# Altium schematic sheet LED_Shield_PCB_v11.SchDoc
size A4; SheetNumber: 1; SheetTotal: 1
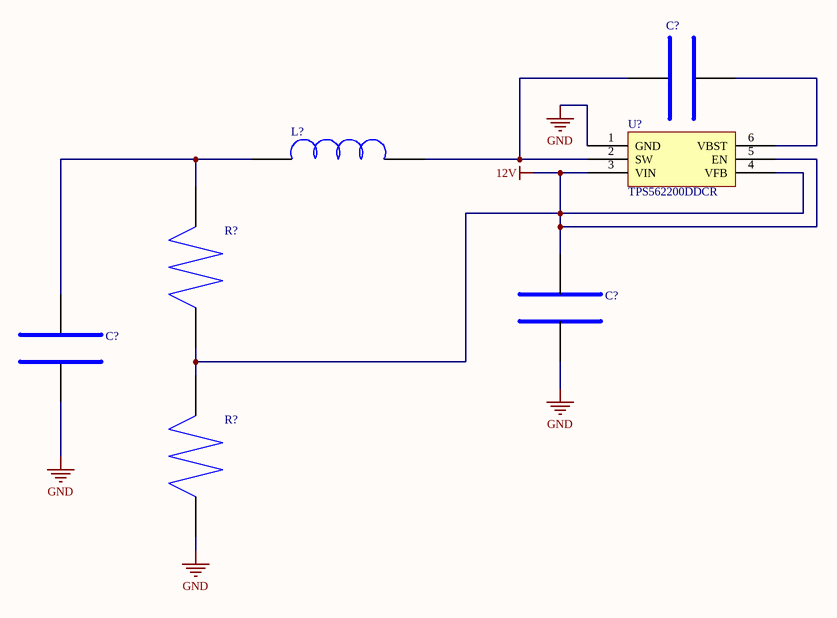
[diagram p0: LED_Shield_PCB_v11.SchDoc]

## Parts
(Parts that share a designator on the sheet are numbered #1, #2 ... from top to bottom, then left to right.)
C?#1  KGM21NR71E104KT  [C_0805 (2012 Metric)_2]  (value not drawn)
C?#2  MSAST219LB5106KTNA01  [C_0805 (2012 Metric)]  (value not drawn)
C?#3  MSASL219LB5226MTNA01  [C_0805 (2012 Metric)_3]  (value not drawn)
L?  XGL4030-472MEC  [L_1616 (4040 Metric)]  (value not drawn)
R?#1  RC0201FR-0756K2L  (value not drawn)
R?#2  RC0201FR-0710KL  [R_0201 (0603 Metric)_2]  (value not drawn)
U?  TPS562200DDCR  [U_SOT-23-6 Thin, TSOT-23-6]

## Nets
12V: C?#2.1 R?#1.0 R?#2.1 U?.3(VIN) U?.4(VFB) U?.5(EN)
GND: C?#2.0 C?#3.0 R?#2.0 U?.1(GND)
NetC?#1_0: C?#1.0 L?.1 U?.2(SW)
NetC?#1_1: C?#1.1 U?.6(VBST)
NetC?#3_1: C?#3.1 L?.0 R?#1.1

## Library data of the parts
C?#1 = KGM21NR71E104KT: Ceramic Capacitor, Multilayer, Ceramic, 25V, 10% +Tol, 10% -Tol, X7R, 15% TC, 0.1uF, Surface Mount, 0805; Manufacturer: KYOCERA AVX; Value: 100nF; Supplier: Future Electronics; Supplier Part Number: 4183759; Manufacturer Part Number: KGM21NR71E104KT; RoHS: Compliant; Category: Ceramic Capacitors; Stock: 4000; Pricing: 4000=0,0166, 12000=0,0162, 20000=0,016, 60000=0,0157, 100000=0,0153 (USD); Dielectric Material: Ceramic; Height: 1mm; Length: 2.01mm; Lifecycle Status: Production; Max Operating Temperature: 125°C; Min Operating Temperature: -55°C; Mounting Technology: Surface Mount; Number of Terminals: 2; REACH SVHC: Yes; Voltage Rating (DC): 25V; Width: 1.25mm; ComponentLink1URL: https://datasheet.octopart.com:443/KGM21NR71E104KT-KYOCERA-AVX-datasheet-179280988.pdf?src-supplier=IHS; ComponentLink1Description: https://datasheet.octopart.com:443/KGM21NR71E104KT-KYOCERA-AVX-datasheet-179280988.pdf?src-supplier=IHS; ComponentLink2URL: https://datasheet.octopart.com:443/KGM21NR71E104KT-KYOCERA-AVX-datasheet-178027269.pdf?src-supplier=TME; ComponentLink2Description: https://datasheet.octopart.com:443/KGM21NR71E104KT-KYOCERA-AVX-datasheet-178027269.pdf?src-supplier=TME; ComponentLink3URL: https://datasheet.octopart.com:443/KGM21NR71E104KT-KYOCERA-AVX-datasheet-175509538.pdf?src-supplier=Future+Electronics; ComponentLink3Description: https://datasheet.octopart.com:443/KGM21NR71E104KT-KYOCERA-AVX-datasheet-175509538.pdf?src-supplier=Future+Electronics; ComponentLink4URL: http://sigma.octopart.com:80/conflict_mineral_statement/AVX-company-34.pdf?src-supplier=Compliance+Statements; ComponentLink4Description: http://sigma.octopart.com:80/conflict_mineral_statement/AVX-company-34.pdf?src-supplier=Compliance+Statements; ComponentLink5URL: http://sigma.octopart.com:80/reach_statement/AVX-company-19.pdf?src-supplier=Compliance+Statements; ComponentLink5Description: http://sigma.octopart.com:80/reach_statement/AVX-company-19.pdf?src-supplier=Compliance+Statements
C?#2 = MSAST219LB5106KTNA01: Ceramic Capacitor, Multilayer, Ceramic, 25V, 10% +Tol, 10% -Tol, X5R, 15% TC, 10uF, Surface Mount, 0805; Manufacturer: TAIYO YUDEN; Value: 10µF; Supplier: Arrow Electronics; Supplier Part Number: MSAST219LB5106KTNA01; Manufacturer Part Number: MSAST219LB5106KTNA01; RoHS: Compliant; Category: Ceramic Capacitors; Stock: 7; Pricing: 1=0,0066 (USD); Dielectric Material: Ceramic; Export Control Classification Number (ECCN) Code: EAR99; Height: 850µm; Harmonized Tariff Schedule (HTS) Code: 8532.24.00.20; Introduction Date: 2022-02-17; Length: 2mm; Lifecycle Status: Production; Max Operating Temperature: 85°C; Min Operating Temperature: -55°C; Mounting Technology: Surface Mount; Number of Terminals: 2; REACH SVHC: Yes; Voltage Rating (DC): 25V; Width: 1.25mm; ComponentLink1URL: https://datasheet.octopart.com:443/MSAST219LB5106KTNA01-Taiyo-Yuden-datasheet-182126366.pdf?src-supplier=IHS; ComponentLink1Description: https://datasheet.octopart.com:443/MSAST219LB5106KTNA01-Taiyo-Yuden-datasheet-182126366.pdf?src-supplier=IHS
C?#3 = MSASL219LB5226MTNA01: Ceramic Capacitor, Multilayer, Ceramic, 10V, 20% +Tol, 20% -Tol, X5R, 15% TC, 22uF, Surface Mount, 0805; Manufacturer: TAIYO YUDEN; Value: 22µF; Supplier: Mouser; Supplier Part Number: 963-MSASL219LB5226MT; Manufacturer Part Number: MSASL219LB5226MTNA01; RoHS: Compliant; Category: Ceramic Capacitors; Stock: 10806; Pricing: 1=0,27, 10=0,114, 50=0,114, 100=0,101, 1000=0,072, 10000=0,067 (USD); Dielectric Material: Ceramic; Export Control Classification Number (ECCN) Code: EAR99; Height: 850µm; Harmonized Tariff Schedule (HTS) Code: 8532.24.00.20; Introduction Date: 2022-02-17; Length: 2mm; Lifecycle Status: Production; Max Operating Temperature: 85°C; Min Operating Temperature: -55°C; Mounting Technology: Surface Mount; Number of Terminals: 2; REACH SVHC: Yes; Voltage Rating (DC): 10V; Width: 1.25mm; ComponentLink1URL: https://datasheet.octopart.com:443/MSASL219LB5226MTNA01-Taiyo-Yuden-datasheet-182125419.pdf?src-supplier=IHS; ComponentLink1Description: https://datasheet.octopart.com:443/MSASL219LB5226MTNA01-Taiyo-Yuden-datasheet-182125419.pdf?src-supplier=IHS
L? = XGL4030-472MEC: 4.7 µH Shielded Molded Inductor 6.6 A 31.5mOhm Max 1616 (4040 Metric)
R?#1 = RC0201FR-0756K2L: Res Thick Film 0201 56.2K Ohm 1% 0.05W(1/20W) ±200ppm/C Molded SMD Paper T/R; Manufacturer: Yageo Group; Max Power Dissipation: 50mW; Value: 56.2kΩ; Temperature Coefficient: 200ppm/°C; Voltage Rating: 25V; Supplier: Farnell; Supplier Part Number: 3951640; Manufacturer Part Number: RC0201FR-0756K2L; RoHS: Compliant; Category: Chip SMD Resistors; Stock: 32331; Pricing: 10=0,0121, 100=0,0086, 500=0,0066, 2500=0,0039, 5000=0,0038 (EUR); Case/Package: 0201; Case Code (Imperial): 0201; Case Code (Metric): 0603; China RoHS: Non-Compliant; Composition: Thick Film; Country of Origin: Mainland China, Taiwan; Depth: 300µm; Export Control Classification Number (ECCN) Code: EAR99; Features: Moisture Resistant; Height: 230µm; Harmonized Tariff Schedule (HTS) Code: 8533.21.00.30; Introduction Date: 2008-07-18; Length: 600µm; Lifecycle Status: Production; Max Operating Temperature: 125°C; Military Standard: Not; Min Operating Temperature: -55°C; Mounting Technology: Surface Mount; Number of Terminals: 2; Number of Terminations: 2; Power Dissipation: 50mW; Power Rating: 50mW; REACH SVHC: Yes; Schedule B: 8533210045, 8533210045|8533210045, 8533210045|8533210045|8533210045, 8533210045|8533210045|8533210045|8533210045; Tolerance: 1%; Width: 300µm; Working Voltage: 25V; ComponentLink1URL: https://datasheet.octopart.com:443/RC0201FR-0756K2L-Yageo-datasheet-175887523.pdf?src-supplier=IHS; ComponentLink1Description: https://datasheet.octopart.com:443/RC0201FR-0756K2L-Yageo-datasheet-175887523.pdf?src-supplier=IHS; ComponentLink2URL: https://datasheet.octopart.com:443/RC0201FR-0756K2L-Yageo-datasheet-13314888.pdf?src-supplier=Upverter; ComponentLink2Description: https://datasheet.octopart.com:443/RC0201FR-0756K2L-Yageo-datasheet-13314888.pdf?src-supplier=Upverter; ComponentLink3URL: https://datasheet.octopart.com:443/RC0201FR-0756K2L-Yageo-datasheet-12549147.pdf?src-supplier=Upverter; ComponentLink3Description: https://datasheet.octopart.com:443/RC0201FR-0756K2L-Yageo-datasheet-12549147.pdf?src-supplier=Upverter; ComponentLink4URL: https://datasheet.octopart.com:443/RC0201FR-0756K2L-Yageo-datasheet-12509741.pdf?src-supplier=Upverter; ComponentLink4Description: https://datasheet.octopart.com:443/RC0201FR-0756K2L-Yageo-datasheet-12509741.pdf?src-supplier=Upverter; ComponentLink5URL: https://datasheet.octopart.com:443/RC0201FR-0756K2L-Yageo-datasheet-12509713.pdf?src-supplier=Upverter; ComponentLink5Description: https://datasheet.octopart.com:443/RC0201FR-0756K2L-Yageo-datasheet-12509713.pdf?src-supplier=Upverter; ComponentLink6URL: https://datasheet.octopart.com:443/RC0201FR-0756K2L-Yageo-Group-datasheet-176638170.pdf?src-supplier=Future+Electronics; ComponentLink6Description: https://datasheet.octopart.com:443/RC0201FR-0756K2L-Yageo-Group-datasheet-176638170.pdf?src-supplier=Future+Electronics; ComponentLink7URL: https://datasheet.octopart.com:443/RC0201FR-0756K2L-Yageo-datasheet-164759695.pdf?src-supplier=Future+Electronics; ComponentLink7Description: https://datasheet.octopart.com:443/RC0201FR-0756K2L-Yageo-datasheet-164759695.pdf?src-supplier=Future+Electronics; ComponentLink8URL: https://datasheet.octopart.com:443/RC0201FR-0756K2L-Yageo-datasheet-137700087.pdf?src-supplier=Future+Electronics; ComponentLink8Description: https://datasheet.octopart.com:443/RC0201FR-0756K2L-Yageo-datasheet-137700087.pdf?src-supplier=Future+Electronics; ComponentLink9URL: https://datasheet.octopart.com/RC0201FR-0756K2L-Yageo-datasheet-73766026.pdf; ComponentLink9Description: https://datasheet.octopart.com/RC0201FR-0756K2L-Yageo-datasheet-73766026.pdf; ComponentLink10URL: http://sigma.octopart.com:80/conflict_mineral_statement/Yageo-company-3.pdf?src-supplier=Compliance+Statements; ComponentLink10Description: http://sigma.octopart.com:80/conflict_mineral_statement/Yageo-company-3.pdf?src-supplier=Compliance+Statements; ComponentLink11URL: http://sigma.octopart.com:80/rohs_statement/Yageo-company-2.pdf?src-supplier=Compliance+Statements; ComponentLink11Description: http://sigma.octopart.com:80/rohs_statement/Yageo-company-2.pdf?src-supplier=Compliance+Statements
R?#2 = RC0201FR-0710KL: Res Thick Film 0201 10K Ohm 1% 0.05W(1/20W) ±200ppm/C Pad SMD T/R; Manufacturer: Yageo Group; Max Power Dissipation: 50mW; Value: 10kΩ; Temperature Coefficient: 200ppm/°C; Voltage Rating: 25V; Supplier: Farnell; Supplier Part Number: 1857008; Manufacturer Part Number: RC0201FR-0710KL; RoHS: Compliant; Category: Chip SMD Resistors; Stock: 170907; Pricing: 10=0,0092, 100=0,0072, 500=0,0059, 2500=0,0046, 5000=0,0045 (EUR); Case/Package: 0201; Case Code (Imperial): 0201; Case Code (Metric): 0603; China RoHS: Non-Compliant; Composition: Thick Film; Contact Plating: Tin; Country of Origin: Mainland China, Taiwan; Depth: 300µm; Export Control Classification Number (ECCN) Code: EAR99; Features: Moisture Resistant; Height: 230µm; Harmonized Tariff Schedule (HTS) Code: 8533.21.00.30; Introduction Date: 2008-07-18; Lead Free: Lead Free; Length: 600µm; Lifecycle Status: Production; Max Operating Temperature: 125°C; Military Standard: Not; Min Operating Temperature: -55°C; Mounting Technology: Surface Mount; Pins: 2; Number of Terminals: 2; Number of Terminations: 2; Packaging: Tape & Reel; Power Dissipation: 50mW; Power Rating: 50mW; Radiation Hardening: No; REACH SVHC: Yes; Schedule B: 8533210045, 8533210045|8533210045|8533210045|8533210045|8533210045|8533210045|8533210045|8533210045|8533210045|8533210045|8533210045|8533210045|8533210045|8533210045|8533210045|8533210045|8533210045|8533210045|8533210045, 8533210045|8533210045|8533210045|8533210045|8533210045|8533210045|8533210045|8533210045|8533210045|8533210045|8533210045|8533210045|8533210045|8533210045|8533210045|8533210045|8533210045|8533210045|8533210045|8533210045, 8533210045|8533210045|8533210045|8533210045|8533210045|8533210045|8533210045|8533210045|8533210045|8533210045|8533210045|8533210045|8533210045|8533210045|8533210045|8533210045|8533210045|8533210045|8533210045|8533210045|8533210045; Termination: SMD/SMT; Tolerance: 1%; Voltage Rating (DC): 25V; Weight: 170.097139µg; Width: 300µm; Working Voltage: 25V; ComponentLink1URL: https://datasheet.octopart.com:443/RC0201FR-0710KL-Yageo-datasheet-175887523.pdf?src-supplier=IHS; ComponentLink1Description: https://datasheet.octopart.com:443/RC0201FR-0710KL-Yageo-datasheet-175887523.pdf?src-supplier=IHS; ComponentLink2URL: https://datasheet.octopart.com:443/RC0201FR-0710KL-Yageo-datasheet-12509713.pdf?src-supplier=element14+APAC; ComponentLink2Description: https://datasheet.octopart.com:443/RC0201FR-0710KL-Yageo-datasheet-12509713.pdf?src-supplier=element14+APAC; ComponentLink3URL: https://datasheet.octopart.com:443/RC0201FR-0710KL-Yageo-datasheet-62067350.pdf?src-supplier=element14+APAC; ComponentLink3Description: https://datasheet.octopart.com:443/RC0201FR-0710KL-Yageo-datasheet-62067350.pdf?src-supplier=element14+APAC; ComponentLink4URL: https://datasheet.octopart.com:443/RC0201FR-0710KL-Yageo-datasheet-10911895.pdf?src-supplier=element14+APAC; ComponentLink4Description: https://datasheet.octopart.com:443/RC0201FR-0710KL-Yageo-datasheet-10911895.pdf?src-supplier=element14+APAC; ComponentLink5URL: https://datasheet.octopart.com:443/RC0201FR-0710KL-Yageo-datasheet-13314888.pdf?src-supplier=Upverter; ComponentLink5Description: https://datasheet.octopart.com:443/RC0201FR-0710KL-Yageo-datasheet-13314888.pdf?src-supplier=Upverter; ComponentLink6URL: https://datasheet.octopart.com:443/RC0201FR-0710KL-Yageo-datasheet-12549147.pdf?src-supplier=Upverter; ComponentLink6Description: https://datasheet.octopart.com:443/RC0201FR-0710KL-Yageo-datasheet-12549147.pdf?src-supplier=Upverter; ComponentLink7URL: https://datasheet.octopart.com:443/RC0201FR-0710KL-Yageo-datasheet-12509741.pdf?src-supplier=Upverter; ComponentLink7Description: https://datasheet.octopart.com:443/RC0201FR-0710KL-Yageo-datasheet-12509741.pdf?src-supplier=Upverter; ComponentLink8URL: https://datasheet.octopart.com:443/RC0201FR-0710KL-Yageo-Group-datasheet-190305687.pdf?src-supplier=Newark; ComponentLink8Description: https://datasheet.octopart.com:443/RC0201FR-0710KL-Yageo-Group-datasheet-190305687.pdf?src-supplier=Newark; ComponentLink9URL: https://datasheet.octopart.com:443/RC0201FR-0710KL-Yageo-datasheet-10025917.pdf?src-supplier=Newark; ComponentLink9Description: https://datasheet.octopart.com:443/RC0201FR-0710KL-Yageo-datasheet-10025917.pdf?src-supplier=Newark; ComponentLink10URL: https://datasheet.octopart.com:443/RC0201FR-0710KL-Yageo-Group-datasheet-176638170.pdf?src-supplier=Future+Electronics; ComponentLink10Description: https://datasheet.octopart.com:443/RC0201FR-0710KL-Yageo-Group-datasheet-176638170.pdf?src-supplier=Future+Electronics; ComponentLink11URL: https://datasheet.octopart.com:443/RC0201FR-0710KL-Yageo-datasheet-164759695.pdf?src-supplier=Future+Electronics; ComponentLink11Description: https://datasheet.octopart.com:443/RC0201FR-0710KL-Yageo-datasheet-164759695.pdf?src-supplier=Future+Electronics; ComponentLink12URL: https://datasheet.octopart.com:443/RC0201FR-0710KL-Yageo-datasheet-127823281.pdf?src-supplier=Future+Electronics; ComponentLink12Description: https://datasheet.octopart.com:443/RC0201FR-0710KL-Yageo-datasheet-127823281.pdf?src-supplier=Future+Electronics; ComponentLink13URL: https://datasheet.octopart.com:443/RC0201FR-0710KL-Yageo-datasheet-137700087.pdf?src-supplier=Future+Electronics; ComponentLink13Description: https://datasheet.octopart.com:443/RC0201FR-0710KL-Yageo-datasheet-137700087.pdf?src-supplier=Future+Electronics; ComponentLink14URL: https://datasheet.octopart.com:443/RC0201FR-0710KL-Yageo-datasheet-103092701.pdf?src-supplier=Future+Electronics; ComponentLink14Description: https://datasheet.octopart.com:443/RC0201FR-0710KL-Yageo-datasheet-103092701.pdf?src-supplier=Future+Electronics; ComponentLink15URL: https://datasheet.octopart.com:443/RC0201FR-0710KL-Yageo-datasheet-98239111.pdf?src-supplier=Future+Electronics; ComponentLink15Description: https://datasheet.octopart.com:443/RC0201FR-0710KL-Yageo-datasheet-98239111.pdf?src-supplier=Future+Electronics; ComponentLink16URL: https://datasheet.octopart.com:443/RC0201FR-0710KL-Yageo-datasheet-44382975.pdf?src-supplier=Future+Electronics; ComponentLink16Description: https://datasheet.octopart.com:443/RC0201FR-0710KL-Yageo-datasheet-44382975.pdf?src-supplier=Future+Electronics; ComponentLink17URL: https://datasheet.octopart.com:443/RC0201FR-0710KL-Yageo-datasheet-41589693.pdf?src-supplier=Future+Electronics; ComponentLink17Description: https://datasheet.octopart.com:443/RC0201FR-0710KL-Yageo-datasheet-41589693.pdf?src-supplier=Future+Electronics; ComponentLink18URL: https://datasheet.octopart.com:443/RC0201FR-0710KL-Yageo-datasheet-37140709.pdf?src-supplier=Future+Electronics; ComponentLink18Description: https://datasheet.octopart.com:443/RC0201FR-0710KL-Yageo-datasheet-37140709.pdf?src-supplier=Future+Electronics; ComponentLink19URL: https://datasheet.octopart.com:443/RC0201FR-0710KL-Yageo-datasheet-12509768.pdf?src-supplier=Future+Electronics; ComponentLink19Description: https://datasheet.octopart.com:443/RC0201FR-0710KL-Yageo-datasheet-12509768.pdf?src-supplier=Future+Electronics; ComponentLink20URL: https://datasheet.octopart.com:443/RC0201FR-0710KL-Yageo-datasheet-12590898.pdf?src-supplier=Future+Electronics; ComponentLink20Description: https://datasheet.octopart.com:443/RC0201FR-0710KL-Yageo-datasheet-12590898.pdf?src-supplier=Future+Electronics; ComponentLink21URL: https://datasheet.octopart.com:443/RC0201FR-0710KL-Yageo-datasheet-5319114.pdf?src-supplier=Future+Electronics; ComponentLink21Description: https://datasheet.octopart.com:443/RC0201FR-0710KL-Yageo-datasheet-5319114.pdf?src-supplier=Future+Electronics; ComponentLink22URL: https://datasheet.octopart.com:443/RC0201FR-0710KL-Yageo-datasheet-12535854.pdf?src-supplier=Future+Electronics; ComponentLink22Description: https://datasheet.octopart.com:443/RC0201FR-0710KL-Yageo-datasheet-12535854.pdf?src-supplier=Future+Electronics; ComponentLink23URL: https://datasheet.octopart.com:443/RC0201FR-0710KL-Yageo-datasheet-148775077.pdf?src-supplier=TME; ComponentLink23Description: https://datasheet.octopart.com:443/RC0201FR-0710KL-Yageo-datasheet-148775077.pdf?src-supplier=TME; ComponentLink24URL: https://datasheet.octopart.com/RC0201FR-0710KL-Yageo-datasheet-73766026.pdf; ComponentLink24Description: https://datasheet.octopart.com/RC0201FR-0710KL-Yageo-datasheet-73766026.pdf; ComponentLink25URL: https://datasheet.octopart.com:443/RC0201FR-0710KL-Yageo-datasheet-8701561.pdf?src-supplier=element14; ComponentLink25Description: https://datasheet.octopart.com:443/RC0201FR-0710KL-Yageo-datasheet-8701561.pdf?src-supplier=element14; ComponentLink26URL: http://sigma.octopart.com:80/conflict_mineral_statement/Yageo-company-3.pdf?src-supplier=Compliance+Statements; ComponentLink26Description: http://sigma.octopart.com:80/conflict_mineral_statement/Yageo-company-3.pdf?src-supplier=Compliance+Statements; ComponentLink27URL: http://sigma.octopart.com:80/rohs_statement/Yageo-company-2.pdf?src-supplier=Compliance+Statements; ComponentLink27Description: http://sigma.octopart.com:80/rohs_statement/Yageo-company-2.pdf?src-supplier=Compliance+Statements
U? = TPS562200DDCR_1: Conv DC-DC 4.5V to 17V Step Down Single-Out 0.67V to 7V 2A 6-Pin TSOT-23 T/R; Manufacturer: Texas Instruments; Manufacturer Lifecycle Status: ACTIVE; Max Duty Cycle: 65%; Max Junction Temperature (Tj): 150°C; Min Output Voltage: 765mV; Nominal Supply Current: 230µA; Number of Channels: 1; Output Configuration: Positive; Output Type: Adjustable; Output Voltage: 1.05V; Switching Frequency: 650kHz; Synchronous Rectifier: Yes; Topology: Buck; Supplier: Arrow Electronics; Supplier Part Number: TPS562200DDCR; Manufacturer Part Number: TPS562200DDCR; RoHS: Compliant; Category: Voltage Regulators - Switching; Stock: 33000; Pricing: 3000=0,3243, 6000=0,3137, 9000=0,3113 (USD); Ambient Temperature Range High: 85°C; Case/Package: SOT-23-6; Contact Plating: Tin; Height: 1.1mm; Lead Free: Lead Free; Length: 2.9mm; Lifecycle Status: Production; Max Supply Voltage: 17V; Max Operating Temperature: 125°C; Max Output current: 2A; Max Output Voltage: 7V; Min Input Voltage: 4.5V; Min Operating Temperature: -40°C; Min Supply Voltage: 4.5V; Mounting Technology: Surface Mount; Number of Outputs: 1; Pins: 6; Operating Supply Voltage: 17V; Output Current: 2A; Quiescent Current: 230µA; Radiation Hardening: No; REACH SVHC: No; Schedule B: 8542390000; Thickness: 870µm; Weight: 36.003894mg; Width: 1.6mm; ComponentLink1URL: https://sigma.octopart.com:443/180581133/technical_drawing/Texas-Instruments-TPS562200DDCR.pdf?src-supplier=Texas+Instruments; ComponentLink1Description: https://sigma.octopart.com:443/180581133/technical_drawing/Texas-Instruments-TPS562200DDCR.pdf?src-supplier=Texas+Instruments; ComponentLink2URL: https://octopart.com:443/opatz8j6/c1?t=2utKubAfpiZARX5nFmsE5hGk-Y-tapj6pD_xDeMavGILmoCS9J2eAjjTjNW5Z9c81h6alCPz7bJak1jHKeuWNAeaEIwGhAOxkrndFGX56Qt-YTBzMSW5WpBFdiamkSgyJwOWbAqhxLCfwYLVTxlMZ3D8olLGDhK9RqQ3qjVP-W0npcJpvlqS_C2JNbfqAdkRII-uSWYYqmMgwYeGA5yIbbvEjU5phFCuYsjJv_b7aQSoOIgzwGiDRTTWzzO_HqVSYJIJZJ4c3RZs3GIMQ7XGM0Tmug74GIe09f5U_717lcCnX6GkmB4tYX5l7RHdDg8UKRkvjrB66qfKxFpTpb8aDJ9_oKYvujJkg67F35zetmHwPDR4DgWTV3Fi_ByFnpJz6qQT-ugHig&src-supplier=Texas+Instruments; ComponentLink2Description: https://octopart.com:443/opatz8j6/c1?t=2utKubAfpiZARX5nFmsE5hGk-Y-tapj6pD_xDeMavGILmoCS9J2eAjjTjNW5Z9c81h6alCPz7bJak1jHKeuWNAeaEIwGhAOxkrndFGX56Qt-YTBzMSW5WpBFdiamkSgyJwOWbAqhxLCfwYLVTxlMZ3D8olLGDhK9RqQ3qjVP-W0npcJpvlqS_C2JNbfqAdkRII-uSWYYqmMgwYeGA5yIbbvEjU5phFCuYsjJv_b7aQSoOIgzwGiDRTTWzzO_HqVSYJIJZJ4c3RZs3GIMQ7XGM0Tmug74GIe09f5U_717lcCnX6GkmB4tYX5l7RHdDg8UKRkvjrB66qfKxFpTpb8aDJ9_oKYvujJkg67F35zetmHwPDR4DgWTV3Fi_ByFnpJz6qQT-ugHig&src-supplier=Texas+Instruments; ComponentLink3URL: https://sigma.octopart.com:443/179311906/technical_drawing/Texas-Instruments-TPS562200DDCR.pdf?src-supplier=Texas+Instruments; ComponentLink3Description: https://sigma.octopart.com:443/179311906/technical_drawing/Texas-Instruments-TPS562200DDCR.pdf?src-supplier=Texas+Instruments; ComponentLink4URL: https://sigma.octopart.com:443/159779760/technical_drawing/Texas-Instruments-TPS562200DDCR.pdf?src-supplier=Texas+Instruments; ComponentLink4Description: https://sigma.octopart.com:443/159779760/technical_drawing/Texas-Instruments-TPS562200DDCR.pdf?src-supplier=Texas+Instruments; ComponentLink5URL: https://sigma.octopart.com:443/149167535/technical_drawing/Texas-Instruments-TPS562200DDCR.pdf?src-supplier=Texas+Instruments; ComponentLink5Description: https://sigma.octopart.com:443/149167535/technical_drawing/Texas-Instruments-TPS562200DDCR.pdf?src-supplier=Texas+Instruments; ComponentLink6URL: https://datasheet.octopart.com:443/TPS562200DDCR-Texas-Instruments-datasheet-37741624.pdf?src-supplier=Texas+Instruments; ComponentLink6Description: https://datasheet.octopart.com:443/TPS562200DDCR-Texas-Instruments-datasheet-37741624.pdf?src-supplier=Texas+Instruments; ComponentLink7URL: https://datasheet.octopart.com:443/TPS562200DDCR-Texas-Instruments-datasheet-32015787.pdf?src-supplier=Texas+Instruments; ComponentLink7Description: https://datasheet.octopart.com:443/TPS562200DDCR-Texas-Instruments-datasheet-32015787.pdf?src-supplier=Texas+Instruments; ComponentLink8URL: https://datasheet.octopart.com:443/TPS562200DDCR-Texas-Instruments-datasheet-22069471.pdf?src-supplier=Texas+Instruments; ComponentLink8Description: https://datasheet.octopart.com:443/TPS562200DDCR-Texas-Instruments-datasheet-22069471.pdf?src-supplier=Texas+Instruments; ComponentLink9URL: https://sigma.octopart.com:443/49250152/technical_drawing/Texas-Instruments-TPS562200DDCR.pdf?src-supplier=Texas+Instruments; ComponentLink9Description: https://sigma.octopart.com:443/49250152/technical_drawing/Texas-Instruments-TPS562200DDCR.pdf?src-supplier=Texas+Instruments; ComponentLink10URL: https://datasheet.octopart.com:443/TPS562200DDCR-Texas-Instruments-datasheet-66617798.pdf?src-supplier=element14+APAC; ComponentLink10Description: https://datasheet.octopart.com:443/TPS562200DDCR-Texas-Instruments-datasheet-66617798.pdf?src-supplier=element14+APAC; ComponentLink11URL: https://datasheet.octopart.com:443/TPS562200DDCR-Texas-Instruments-datasheet-62313215.pdf?src-supplier=Newark; ComponentLink11Description: https://datasheet.octopart.com:443/TPS562200DDCR-Texas-Instruments-datasheet-62313215.pdf?src-supplier=Newark; ComponentLink12URL: https://datasheet.octopart.com:443/TPS562200DDCR-Texas-Instruments-datasheet-62292600.pdf?src-supplier=Farnell; ComponentLink12Description: https://datasheet.octopart.com:443/TPS562200DDCR-Texas-Instruments-datasheet-62292600.pdf?src-supplier=Farnell; ComponentLink13URL: https://datasheet.octopart.com:443/TPS562200DDCR-Texas-Instruments-datasheet-165804781.pdf?src-supplier=LCSC; ComponentLink13Description: https://datasheet.octopart.com:443/TPS562200DDCR-Texas-Instruments-datasheet-165804781.pdf?src-supplier=LCSC; ComponentLink14URL: https://datasheet.octopart.com:443/TPS562200DDCR-Texas-Instruments-datasheet-159118148.pdf?src-supplier=LCSC; ComponentLink14Description: https://datasheet.octopart.com:443/TPS562200DDCR-Texas-Instruments-datasheet-159118148.pdf?src-supplier=LCSC; ComponentLink15URL: https://datasheet.octopart.com:443/TPS562200DDCR-Texas-Instruments-datasheet-137316104.pdf?src-supplier=Future+Electronics; ComponentLink15Description: https://datasheet.octopart.com:443/TPS562200DDCR-Texas-Instruments-datasheet-137316104.pdf?src-supplier=Future+Electronics; ComponentLink16URL: http://sigma.octopart.com:80/reach_statement/Texas-Instruments-company-64.pdf?src-supplier=Compliance+Statements; ComponentLink16Description: http://sigma.octopart.com:80/reach_statement/Texas-Instruments-company-64.pdf?src-supplier=Compliance+Statements; ComponentLink17URL: http://sigma.octopart.com:80/conflict_mineral_statement/Texas-Instruments-company-63.pdf?src-supplier=Compliance+Statements; ComponentLink17Description: http://sigma.octopart.com:80/conflict_mineral_statement/Texas-Instruments-company-63.pdf?src-supplier=Compliance+Statements